# EAGLE design Universal Siebensegment Display (EAGLE 4.16)
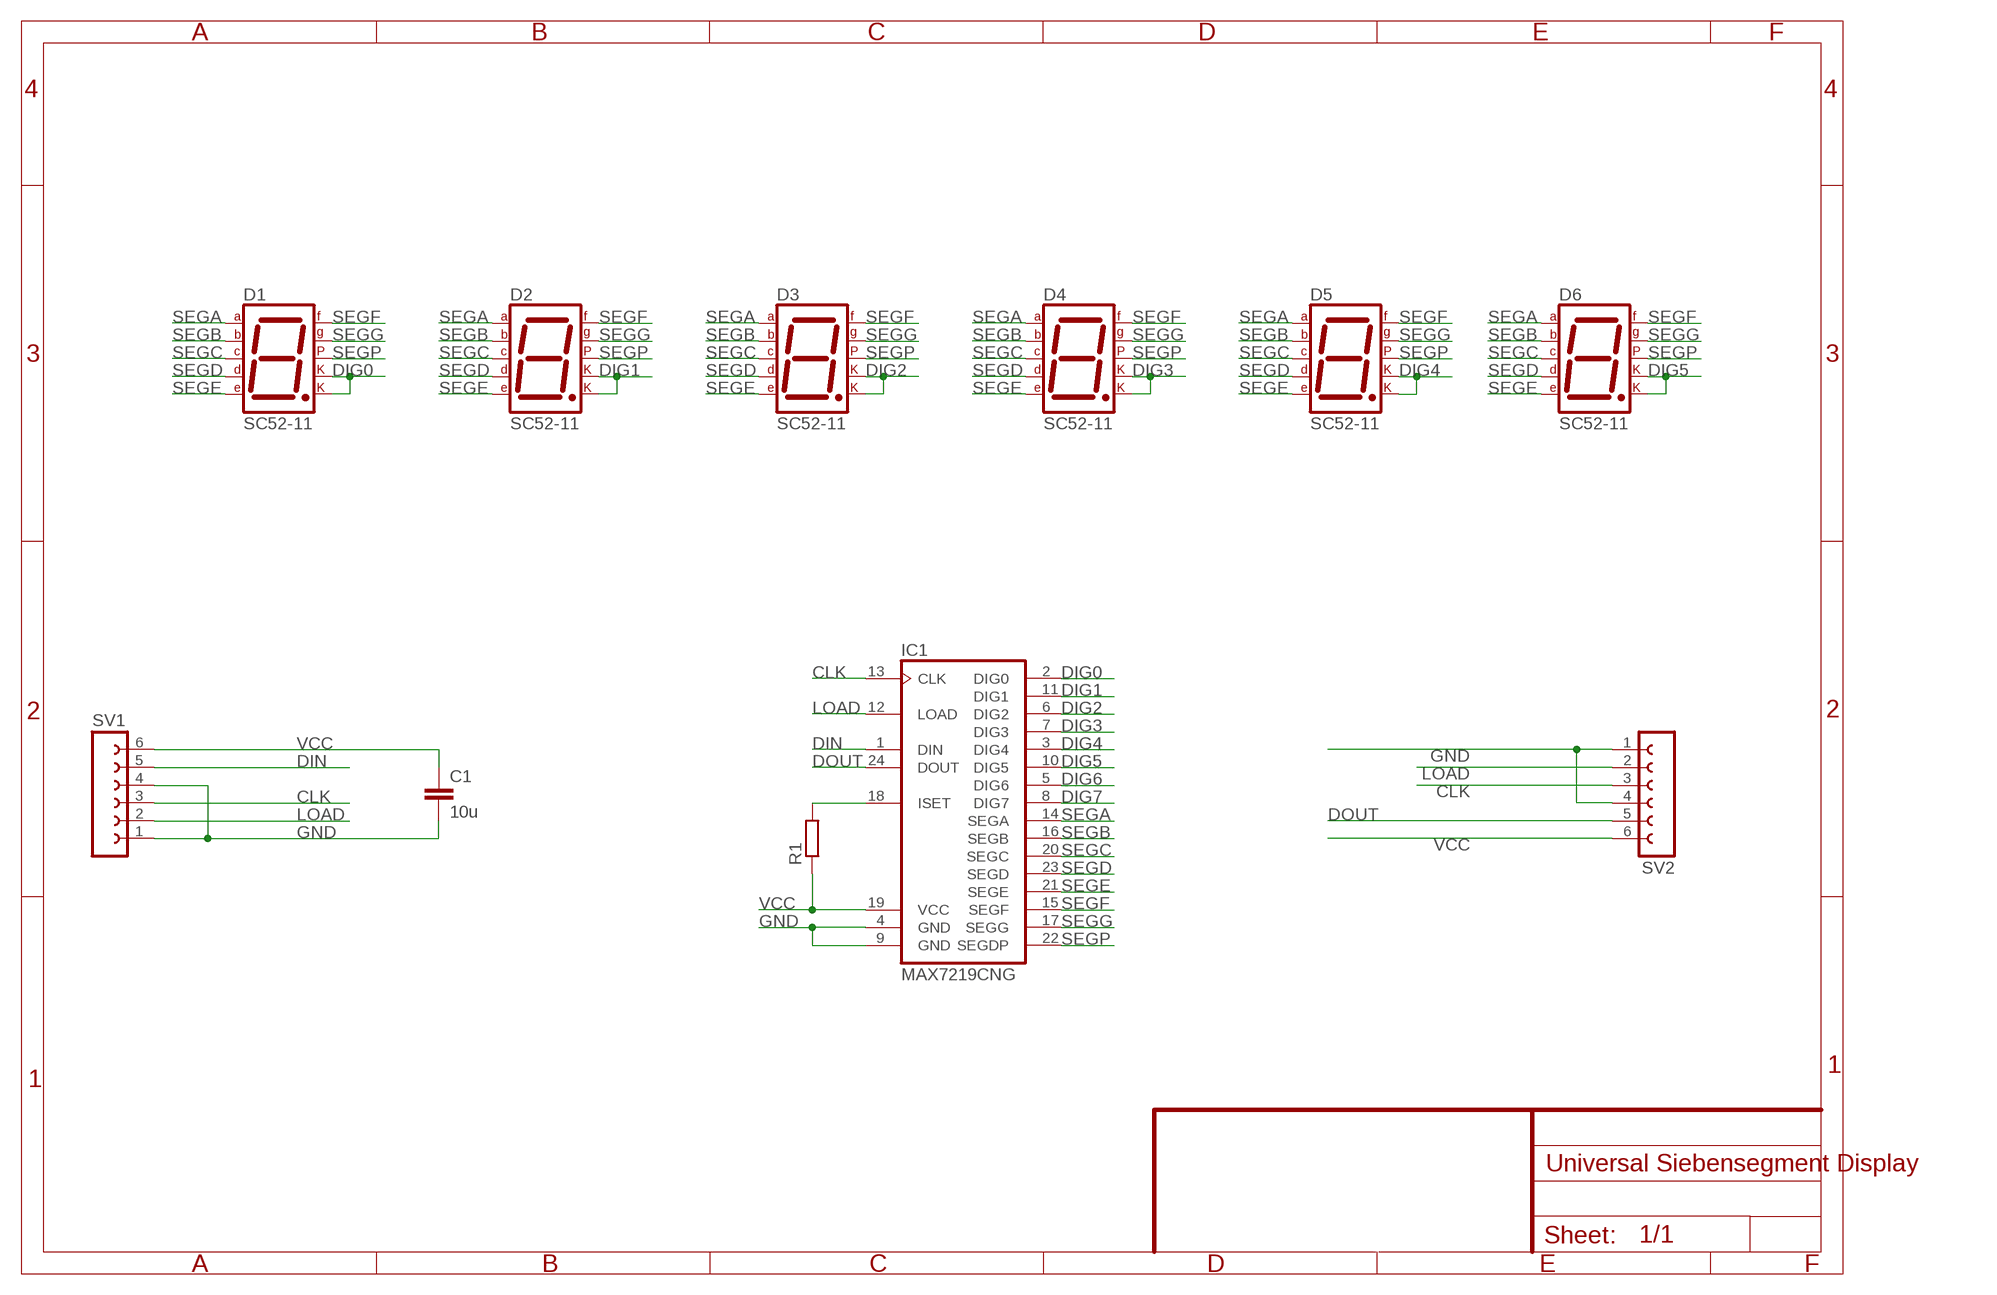
[diagram p0: schematic, sheet 1]

## Parts
C1  10u  C-EUC1210  [C1210]
D1  SC52-11  7SEG-CK  [7SEG-13]
D2  SC52-11  7SEG-CK  [7SEG-13]
D3  SC52-11  7SEG-CK  [7SEG-13]
D4  SC52-11  7SEG-CK  [7SEG-13]
D5  SC52-11  7SEG-CK  [7SEG-13]
D6  SC52-11  7SEG-CK  [7SEG-13]
IC1  MAX7219CNG  [DIL24-3]
R1  R-EU_0207/10  [0207/10]
SV1  FE06-1  [FE06]
SV2  FE06-1  [FE06]

## Nets
CLK: IC1.13(CLK) SV1.3 SV2.3
DIG0: D1.3(CK1) D1.8(CK2) IC1.2(DIG0)
DIG1: D2.3(CK1) D2.8(CK2) IC1.11(DIG1)
DIG2: D3.3(CK1) D3.8(CK2) IC1.6(DIG2)
DIG3: D4.3(CK1) D4.8(CK2) IC1.7(DIG3)
DIG4: D5.3(CK1) D5.8(CK2) IC1.3(DIG4)
DIG5: D6.3(CK1) D6.8(CK2) IC1.10(DIG5)
DIG6: IC1.5(DIG6)
DIG7: IC1.8(DIG7)
DIN: IC1.1(DIN) SV1.5
DOUT: IC1.24(DOUT) SV2.5
GND: C1.2 IC1.4(GND) IC1.9(GND) SV1.1 SV1.4 SV2.1 SV2.4
LOAD: IC1.12(LOAD) SV1.2 SV2.2
N$1: IC1.18(ISET) R1.2
SEGA: D1.7(A) D2.7(A) D3.7(A) D4.7(A) D5.7(A) D6.7(A) IC1.14(SEGA)
SEGB: D1.6(B) D2.6(B) D3.6(B) D4.6(B) D5.6(B) D6.6(B) IC1.16(SEGB)
SEGC: D1.4(C) D2.4(C) D3.4(C) D4.4(C) D5.4(C) D6.4(C) IC1.20(SEGC)
SEGD: D1.2(D) D2.2(D) D3.2(D) D4.2(D) D5.2(D) D6.2(D) IC1.23(SEGD)
SEGE: D1.1(E) D2.1(E) D3.1(E) D4.1(E) D5.1(E) D6.1(E) IC1.21(SEGE)
SEGF: D1.9(F) D2.9(F) D3.9(F) D4.9(F) D5.9(F) D6.9(F) IC1.15(SEGF)
SEGG: D1.10(G) D2.10(G) D3.10(G) D4.10(G) D5.10(G) D6.10(G) IC1.17(SEGG)
SEGP: D1.5(DP) D2.5(DP) D3.5(DP) D4.5(DP) D5.5(DP) D6.5(DP) IC1.22(SEGDP)
VCC: C1.1 IC1.19(VCC) R1.1 SV1.6 SV2.6

## Library data of the parts
C1 = rcl:C-EU: CAPACITOR, European symbol
D1-D6 = special:7SEG-CK: 7-segment DISPLAY single cathode, 13 mm
IC1 = maxim:MAX7219CNG: LED DISPLAY DRIVER
R1 = rcl:R-EU_: RESISTOR, European symbol
SV1 SV2 = con-lsta:FE06-1: FEMALE HEADER

## Board
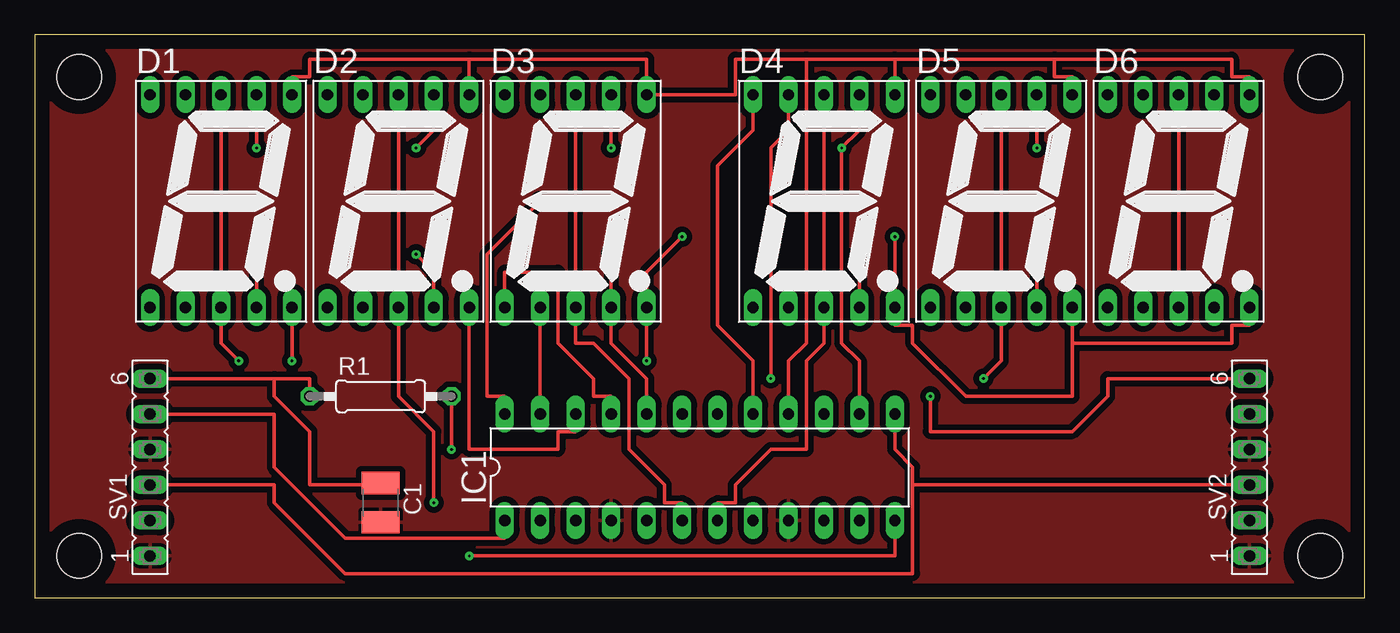
[diagram p1: board, top side]
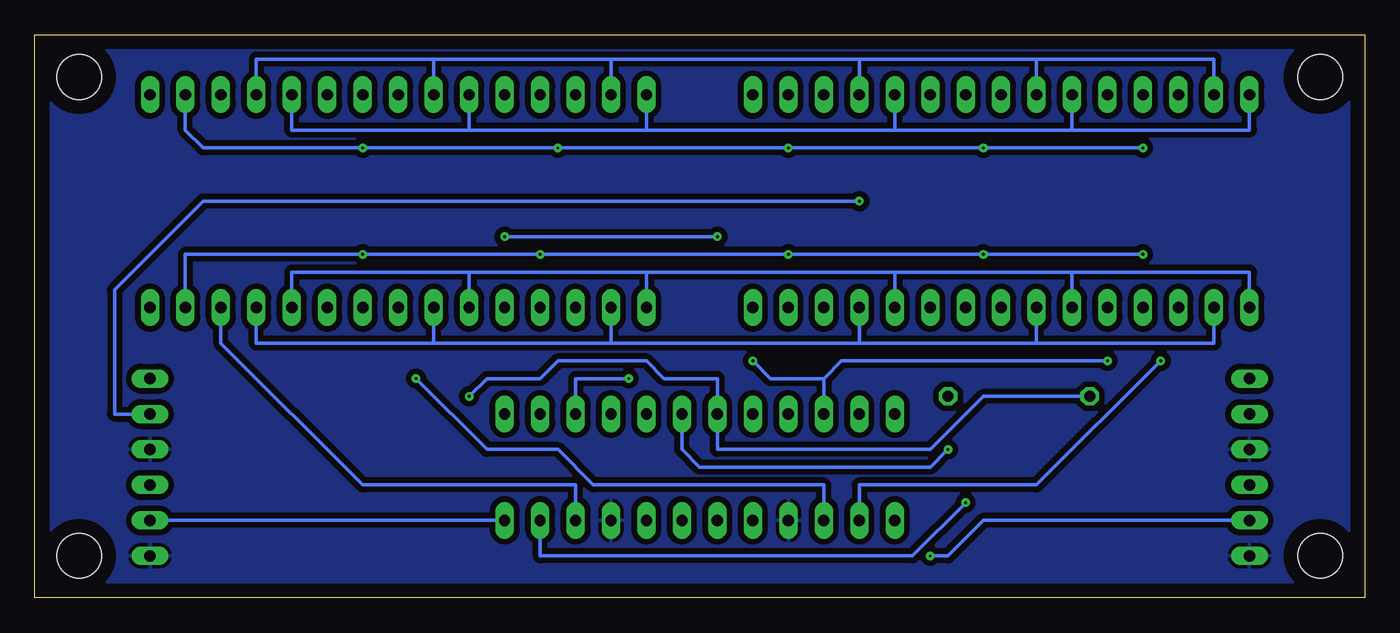
[diagram p2: board, bottom side, seen from below]

Size 95.23 x 40.31 mm. Coordinates in mm from the lower left corner, seen from the top.
Outline: 0,0 95.23,0 95.23,40.31 0,40.31 0,0
Copper layers (1*16): Top 0.035mm / dielectric 1.5mm / Bottom 0.035mm
Design rules "default": minimum track width 10mil, minimum drill 8mil, track to track 8mil, track to pad 8mil, pad to pad 8mil, via to via 8mil, smd to smd 8mil, copper to edge 40mil, drill to drill 6mil, minimum pad ring 10mil, minimum via ring 8mil, stop-mask expansion 4mil, vias tented up to drill 0mil, thermal gap 10mil
Holes 3.2 mm at 3.17,3.01 3.17,37.3 92.07,3.01 92.07,37.3

### Footprints (pad centres in the part's own frame; a part is rotated, then mirrored left to right if it is on the bottom)
C1210 = smd 1.6 x 2.7: 1 -1.4,0; 2 1.4,0
7SEG-13 = drill 0.813 long: 1 -5.08,-7.62; 2 -2.54,-7.62; 3 0,-7.62; 4 2.54,-7.62; 5 5.08,-7.62; 6 5.08,7.62; 7 2.54,7.62; 8 0,7.62; 9 -2.54,7.62; 10 -5.08,7.62
DIL24-3 = drill 0.813 long: 1 -13.97,-3.81; 2 -11.43,-3.81; 3 -8.89,-3.81; 4 -6.35,-3.81; 5 -3.81,-3.81; 6 -1.27,-3.81; 7 1.27,-3.81; 8 3.81,-3.81; 9 6.35,-3.81; 10 8.89,-3.81; 11 11.43,-3.81; 12 13.97,-3.81; 13 13.97,3.81; 14 11.43,3.81; 15 8.89,3.81; 16 6.35,3.81; 17 3.81,3.81; 18 1.27,3.81; 19 -1.27,3.81; 20 -3.81,3.81; 21 -6.35,3.81; 22 -8.89,3.81; 23 -11.43,3.81; 24 -13.97,3.81
0207/10 = drill 0.813 octagon: 1 -5.08,0; 2 5.08,0
FE06 = drill 0.813 long: 1 -6.35,0; 2 -3.81,0; 3 -1.27,0; 4 1.27,0; 5 3.81,0; 6 6.35,0

### Placement (x,y rotation side)
C1  24.76,6.82 270 top
D1  13.33,28.41 0 top
D2  26.03,28.41 0 top
D3  38.73,28.41 0 top
D4  56.51,28.41 0 top
D5  69.21,28.41 0 top
D6  81.91,28.41 0 top
IC1  47.62,9.36 0 top
R1  24.76,14.44 0 top
SV1  8.25,9.36 90 top
SV2  86.99,9.36 90 top

### Tracks (layer width: path | path; a pad name or v marks a point on that pad's centre or on a via)
CLK
  Top 0.254: 62.86,8.09 62.86,9.36 61.59,10.63 IC1.13 | 62.86,8.09 62.86,1.74 22.22,1.74 17.14,6.82 17.14,8.09 SV1.3 | 62.86,8.09 SV2.3
DIG0  (via drill 0.2)
  Top 0.254: D1.8 D1.3 13.33,18.25 v14.6,16.98
  Bottom 0.254: v14.6,16.98 23.49,8.09 36.19,8.09 IC1.2
DIG1  (via drill 0.2)
  Top 0.254: D2.8 D2.3 26.03,14.44 28.57,11.9 v28.57,6.82
  Bottom 0.254: v28.57,6.82 32.38,3.01 59.05,3.01 IC1.11
DIG2
  Top 0.254: D3.8 D3.3 38.73,18.25 40,18.25 42.54,15.71 42.54,10.63 45.08,8.09 45.08,6.82 46.35,6.82 IC1.6
DIG3
  Top 0.254: IC1.7 48.89,6.82 50.16,6.82 50.16,8.09 52.7,10.63 55.24,10.63 55.24,16.98 56.51,18.25 D4.3 D4.8
DIG4  (via drill 0.2)
  Top 0.254: v67.94,15.71 69.21,16.98 D5.3 D5.8
  Bottom 0.254: v67.94,15.71 62.86,10.63 57.78,10.63 55.24,8.09 38.73,8.09 IC1.3
DIG5
  Top 0.254: D6.3 D6.8
  Bottom 0.254: IC1.10 56.51,8.09 71.75,8.09 81.91,18.25 D6.3
DIN
  Top 0.254: SV1.5 17.14,13.17 17.14,9.36 22.22,4.28 33.65,4.28 IC1.1
DOUT  (via drill 0.2)
  Top 0.254: v36.19,28.41 32.38,24.6 32.38,14.44 33.65,14.44 IC1.24
  Bottom 0.254: v36.19,28.41 83.18,28.41 89.53,22.06 89.53,13.17 SV2.5
GND
  pour Bottom (isolate 0.406): 0.63,39.84 0.63,0.47 94.61,0.47 94.61,39.84
  pour Top (isolate 0.406): 0.63,0.47 94.61,0.47 94.61,39.84 0.63,39.84
  pour Bottom (isolate 0.406): 0.63,0.47 94.61,0.47 94.61,39.84 0.63,39.84
LOAD  (via drill 0.2)
  Top 0.254: v31.11,3.01 61.59,3.01 IC1.12
  Bottom 0.254: v31.11,3.01 29.84,3.01 27.3,5.55 SV1.2 | IC1.12 SV2.2
N$1  (via drill 0.2)
  Top 0.254: v29.84,10.63 R1.2
  Bottom 0.254: v29.84,10.63 31.11,9.36 47.62,9.36 48.89,10.63 IC1.18
SEGA  (via drill 0.2)
  Top 0.254: IC1.14 59.05,16.98 57.78,18.25 v57.78,32.22 59.05,33.49 D4.7 | v71.75,32.22 D5.7 | v27.3,32.22 28.57,33.49 D2.7 | v15.87,32.22 D1.7 | v41.27,32.22 D3.7
  Bottom 0.254: D6.7 84.45,33.49 83.18,32.22 v71.75,32.22 v57.78,32.22 v41.27,32.22 v27.3,32.22 v15.87,32.22
SEGB
  Top 0.254: 31.11,38.57 19.68,38.57 19.68,37.3 18.41,37.3 D1.6 | 31.11,38.57 D2.6 | 55.24,38.57 55.24,18.25 53.97,16.98 IC1.16 | 55.24,38.57 61.59,38.57 | 61.59,38.57 D4.6 | 55.24,38.57 50.16,38.57 50.16,36.03 D3.6 43.81,38.57 31.11,38.57 | 73.02,38.57 73.02,37.3 74.29,37.3 D5.6 | 61.59,38.57 73.02,38.57 | 73.02,38.57 85.72,38.57 85.72,37.3 86.99,37.3 D6.6
SEGC  (via drill 0.2)
  Top 0.254: IC1.20 43.81,15.71 41.27,18.25 D3.4 v41.27,24.6 | v27.3,24.6 28.57,23.33 D2.4 | D1.4 v15.87,24.6 | v59.05,24.6 D4.4 | v71.75,24.6 D5.4
  Bottom 0.254: v15.87,24.6 v27.3,24.6 v41.27,24.6 v59.05,24.6 v71.75,24.6 84.45,24.6 D6.4
SEGD
  Top 0.254: D3.2 IC1.23
  Bottom 0.254: 53.97,18.25 66.67,18.25 | 53.97,18.25 D4.2 | 66.67,18.25 D5.2 | 66.67,18.25 79.37,18.25 D6.2 | 23.49,18.25 10.79,18.25 D1.2 | 23.49,18.25 D2.2 | 23.49,18.25 36.19,18.25 | 36.19,18.25 D3.2 | 36.19,18.25 53.97,18.25
SEGE
  Top 0.254: IC1.21 41.27,14.44 40,14.44 40,15.71 37.46,18.25 37.46,23.33 33.65,23.33 D3.1
  Bottom 0.254: 20.95,23.33 8.25,23.33 D1.1 | 20.95,23.33 D2.1 | 20.95,23.33 33.65,23.33 | 33.65,23.33 D3.1 | 33.65,23.33 51.43,23.33 | 51.43,23.33 D4.1 | 51.43,23.33 64.13,23.33 | 64.13,23.33 D5.1 | 64.13,23.33 76.83,23.33 D6.1
SEGF  (via drill 0.2)
  Top 0.254: v52.7,15.71 52.7,32.22 53.97,33.49 D4.9
  Bottom 0.254: 23.49,38.57 10.79,38.57 D1.9 | 23.49,38.57 D2.9 | 23.49,38.57 36.19,38.57 | 36.19,38.57 D3.9 | 36.19,38.57 53.97,38.57 | 53.97,38.57 D4.9 | v52.7,15.71 56.51,15.71 IC1.15 | 53.97,38.57 66.67,38.57 | 66.67,38.57 D5.9 | 66.67,38.57 79.37,38.57 D6.9
SEGG
  Top 0.254: IC1.17 51.43,16.98 48.89,19.52 48.89,30.95 51.43,33.49 D4.10
  Bottom 0.254: 20.95,33.49 8.25,33.49 D1.10 | 20.95,33.49 D2.10 | 20.95,33.49 33.65,33.49 | 33.65,33.49 D3.10 | 51.43,33.49 64.13,33.49 | 64.13,33.49 D5.10 | 51.43,33.49 D4.10 | 64.13,33.49 76.83,33.49 D6.10 | 33.65,33.49 51.43,33.49
SEGP  (via drill 0.2)
  Top 0.254: 74.29,18.25 74.29,14.44 66.67,14.44 62.86,18.25 62.86,19.52 61.59,19.52 D4.5 v61.59,25.87 | 74.29,18.25 D5.5 | 74.29,18.25 85.72,18.25 85.72,19.52 86.99,19.52 D6.5 | IC1.22 38.73,11.9 37.46,11.9 37.46,10.63 31.11,10.63 D2.5 | v18.41,16.98 D1.5 | v43.81,16.98 D3.5 43.81,23.33 v46.35,25.87
  Bottom 0.254: v18.41,16.98 37.46,16.98 38.73,15.71 | 38.73,15.71 IC1.22 | v43.81,16.98 42.54,15.71 38.73,15.71 | v46.35,25.87 v61.59,25.87
VCC  (via drill 0.2)
  Top 0.254: 17.14,15.71 19.68,15.71 R1.1 | SV1.6 17.14,15.71 | 17.14,15.71 17.14,14.44 19.68,11.9 19.68,8.09 23.49,8.09 C1.1 | v64.13,14.44 64.13,11.9 74.29,11.9 76.83,14.44 76.83,15.71 SV2.6
  Bottom 0.254: R1.1 27.3,14.44 31.11,10.63 46.35,10.63 IC1.19 46.35,15.71 50.16,15.71 51.43,16.98 57.78,16.98 59.05,15.71 62.86,15.71 v64.13,14.44